# Altium schematic sheet power-supply_project-nr-22_Sch.SchDoc
size A4; SheetNumber: 1; SheetTotal: 1
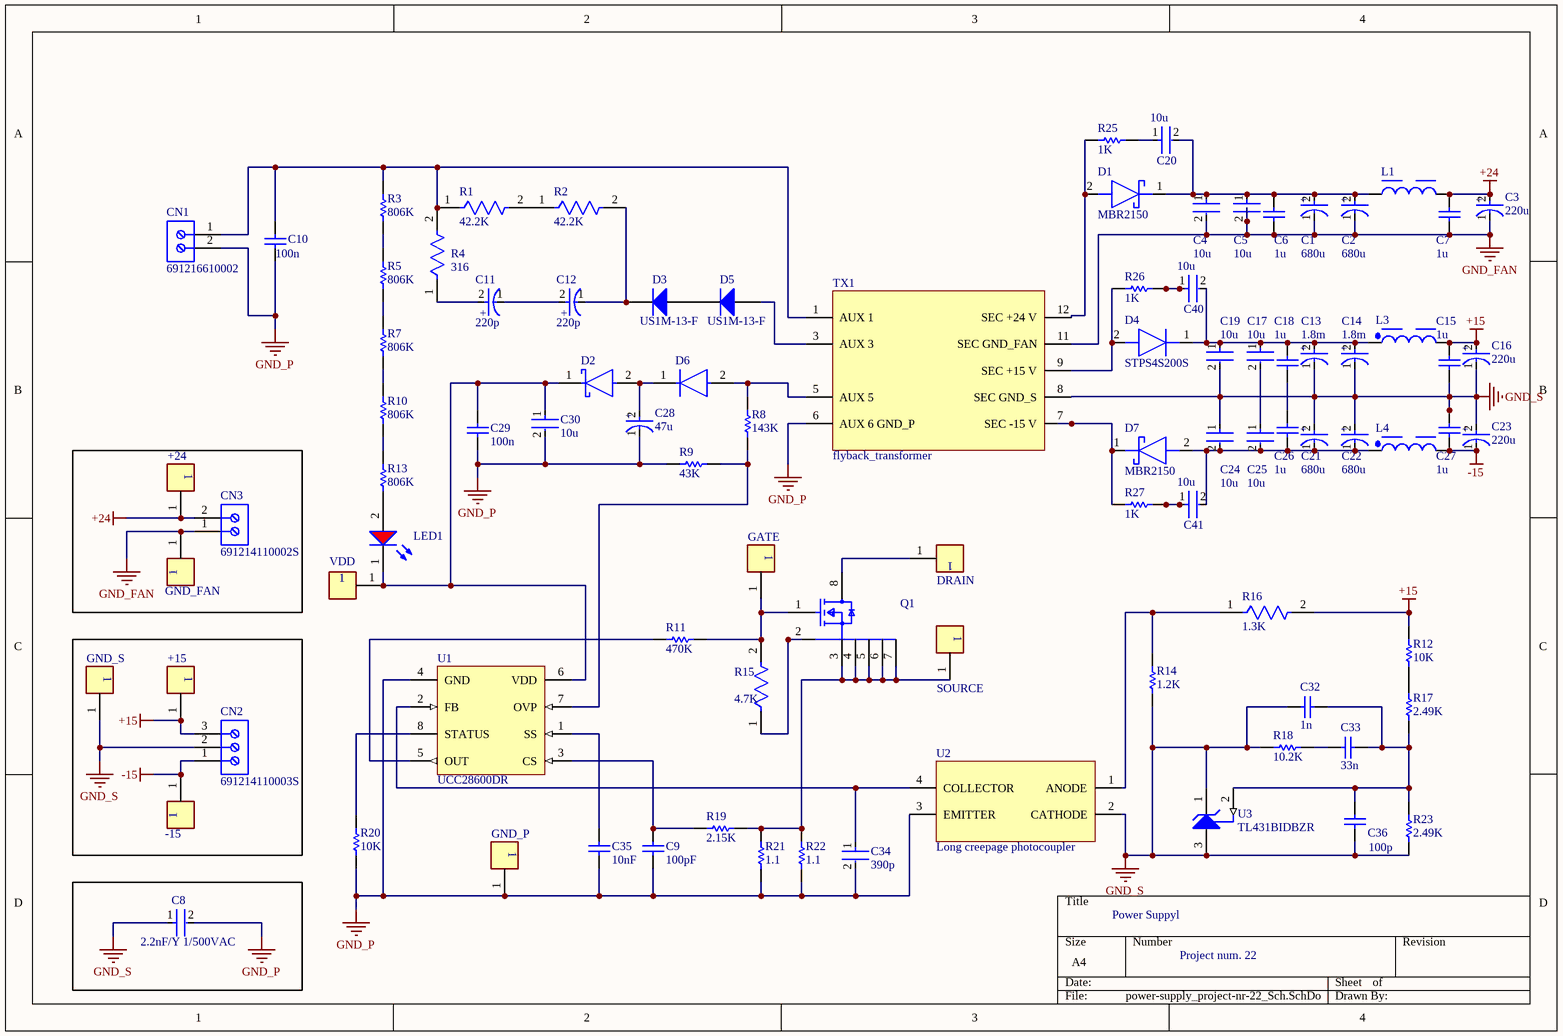
[diagram p0: power-supply_project-nr-22_Sch.SchDoc]

## Parts
+15  5002  [FP-5002-MFG]  (value not drawn)
+24  5002  [FP-5002-MFG]  (value not drawn)
-15  5002  [FP-5002-MFG]  (value not drawn)
C1  680u  [FP-EEU-FM1V681B-MFG]
C2  680u  [FP-EEU-FM1V681B-MFG]
C3  220u  [FP-UWT1V221MNL1GS-MFG]
C4  10u  [FP-C3216-160-0_3-MFG]
C5  10u  [FP-C3216-160-0_3-MFG]
C6  1u  [WCAP-CSGP_0805_L2W1.25H1.25]
C7  1u  [WCAP-CSGP_0805_L2W1.25H1.25]
C8  2.2nF/Y 1/500VAC  [FP-DE1_D11_T6_F10_d0_6-0-MFG]
C9  100pF  [WCAP-CSGP_0603_L1.6W0.8H0.8_Reflow]
C10  100n  [WCAP-FTBE_L18W8.5H15]
C11  220p  [FP-EEH-D-MFG]
C12  220p  [FP-EEH-D-MFG]
C13  1.8m  [FP-RAD-TH-D_10_0_5-L_25_2-MFG]
C14  1.8m  [FP-RAD-TH-D_10_0_5-L_25_2-MFG]
C15  1u  [WCAP-CSGP_0805_L2W1.25H1.25]
C16  220u  [FP-UWT1V221MNL1GS-MFG]
C17  10u  [FP-C3216-160-0_3-MFG]
C18  1u  [WCAP-CSGP_0805_L2W1.25H1.25]
C19  10u  [FP-C3216-160-0_3-MFG]
C20  10u  [FP-C3216-160-0_3-MFG]
C21  680u  [FP-EEU-FM1V681B-MFG]
C22  680u  [FP-EEU-FM1V681B-MFG]
C23  220u  [FP-UWT1V221MNL1GS-MFG]
C24  10u  [FP-C3216-160-0_3-MFG]
C25  10u  [FP-C3216-160-0_3-MFG]
C26  1u  [WCAP-CSGP_0805_L2W1.25H1.25]
C27  1u  [WCAP-CSGP_0805_L2W1.25H1.25]
C28  47u  [FP-HDD8-MFG]
C29  100n  [WCAP-CSGP_0603_L1.6W0.8H0.8_Reflow]
C30  10u  [FP-C3216-160-0_3-MFG]
C32  1n  [WCAP-CSGP_0603_L1.6W0.8H0.8_Reflow]
C33  33n  [WCAP-CSGP_0603_L1.6W0.8H0.8_Reflow]
C34  390p  [FP-C0603C-CF-MFG]
C35  10nF  [WCAP-CSGP_0603_L1.6W0.8H0.8_Reflow]
C36  100p  [WCAP-CSGP_0603_L1.6W0.8H0.8_Reflow]
C40  10u  [FP-C3216-160-0_3-MFG]
C41  10u  [FP-C3216-160-0_3-MFG]
CN1  691216610002  [691216610002]
CN2  691214110003S  [691214110003S]
CN3  691214110002S  [691214110002S]
D1  MBR2150  [DIOAD1910W86L670D310]
D2  MBR0540  [FP-425-04-MFG]  (value not drawn)
D3  US1M-13-F  [DIOD-SMA-2_A_V]
D4  STPS4S200S  [DIOM8059X265N]
D5  US1M-13-F  [DIOD-SMA-2_A_V]
D6  US1D-E3/61T  [FP-95400-MFG]  (value not drawn)
D7  MBR2150  [DIOAD1910W86L670D310]
DRAIN  5002  [FP-5002-MFG]  (value not drawn)
GATE  5002  [FP-5002-MFG]  (value not drawn)
GND_FAN  5002  [FP-5002-MFG]  (value not drawn)
GND_P  5002  [FP-5002-MFG]  (value not drawn)
GND_S  5002  [FP-5002-MFG]  (value not drawn)
L1  744025003  [WE-TPC_2828]  (value not drawn)
L3  7440520018  [WE-TPC_5818]  (value not drawn)
L4  744773022  [WE-PD2_4532]  (value not drawn)
LED1  150080RS75000  [WL-SMCW_0805_150080xx75000]  (value not drawn)
Q1  IMBF170R1K0M1XTMA1  [FP-PG-TO263-7-MFG]  (value not drawn)
R1  42.2K  [FP-RN55-MFG]
R2  42.2K  [FP-RN55-MFG]
R3  806K  [RESC3116X65X40NL10T20]
R4  316  [FP-CRCW0402-e3-MFG]
R5  806K  [RESC3116X65X40NL10T20]
R7  806K  [RESC3116X65X40NL10T20]
R8  143K  [RESC3116X65X40ML10T20]
R9  43K  [RESC1206(3216)_N]
R10  806K  [RESC3116X65X40NL10T20]
R11  470K  [RESC3116X65X40LL10T20]
R12  10K  [RESC3116X65X40ML10T20]
R13  806K  [RESC3116X65X40NL10T20]
R14  1.2K  [RESC0603X26X15LL03T05]
R15  4.7K  [FP-RC1206-0_65-IPC_B]
R16  1.3K  [FP-CRCW0805-e3-IPC_A]
R17  2.49K  [RESC3116X65X40ML10T20]
R18  10.2K  [RESC3116X65X40LL10T20]
R19  2.15K  [RESC1005X40X25ML05T05]
R20  10K  [RESC3116X65X40ML10T20]
R21  1.1  [RESC1608X55X30NL20T10]
R22  1.1  [RESC1608X55X30NL20T10]
R23  2.49K  [RESC3116X65X40ML10T20]
R25  1K  [RESC1608X55X30LL15T15]
R26  1K  [RESC1608X55X30LL15T15]
R27  1K  [RESC1608X55X30LL15T15]
SOURCE  5002  [FP-5002-MFG]  (value not drawn)
TX1  flyback_transformer  [flyback_transformer]
U1  UCC28600DR  [D0008A_M]
U2  Long creepage photocoupler  [PCBComponent_1]
U3  TL431BIDBZR  [DBZ0003A_N]
VDD  5002  [FP-5002-MFG]  (value not drawn)

## Nets
+15: +15.1 C15.2 C16.2(A) CN2.3 L3.2 R12.2 R16.2
+24: +24.1 C3.2(A) C7.2 CN3.2 L1.2
-15: -15.1 C23.1(C) C27.1 CN2.1 L4.2
GND_FAN: C1.1(C) C2.1(C) C3.1(C) C4.2 C5.2 C6.1 C7.1 CN3.1 GND_FAN.1 TX1.11(SEC_GND_FAN)
GND_P: C8.2 C9.1 C10.1 C28.1(C) C29.1 C30.2 C34.2 C35.1 CN1.2 GND_P.1 R9.1 R20.1 R21.1 R22.1 TX1.6(AUX_6_GND_P) U1.4(GND) U2.3(EMITTER)
GND_S: C8.1 C13.1(C) C14.1(C) C15.1 C16.1(C) C19.2 C21.2(A) C22.2(A) C23.2(A) C24.1 C27.2 C32.1 C36.1 CN2.2 GND_S.1 R14.1 R18.1 R23.1 TX1.8(SEC_GND_S) U2.2(CATHODE) U3.1(CATHODE) U3.3(ANODE)
NetC1_2: C1.2(A) C2.2(A) C4.1 C5.1 C6.2 C20.2 D1.1(K) L1.1
NetC9_2: C9.2 R19.1 U1.3(CS)
NetC10_2: C10.2 CN1.1 R1.1 R3.2 R4.2 TX1.1(AUX_1)
NetC11_1: C11.1(C) C12.2(A)
NetC11_2: C11.2(A) R4.1
NetC12_1: C12.1(C) D3.2(K) R2.2
NetC13_2: C13.2(A) C14.2(A) C17.1 C18.2 C19.1 C40.2 D4.1(K) L3.1
NetC17_2: C17.2 C25.1
NetC18_1: C18.1 C26.2
NetC20_1: C20.1 R25.2
NetC21_1: C21.1(C) C22.1(C) C24.2 C25.2 C26.1 C41.2 D7.2(A) L4.1
NetC28_2: C28.2(A) D2.2(A) D6.1(C)
NetC29_2: C29.2 C30.1 D2.1(C) LED1.1(K) U1.6(VDD) VDD.1
NetC32_2: C32.2 C33.2 C36.2 R17.1 R23.2 U3.2(REF)
NetC33_1: C33.1 R18.2
NetC34_1: C34.1 U1.2(FB) U2.4(COLLECTOR)
NetC35_2: C35.2 U1.1(SS)
NetC40_1: C40.1 R26.2
NetC41_1: C41.1 R27.2
NetD1_2: D1.2(A) R25.1 TX1.12(SEC_+24_V)
NetD3_1: D3.1(A) D5.2(K)
NetD4_2: D4.2(A) R26.1 TX1.9(SEC_+15_V)
NetD5_1: D5.1(A) TX1.3(AUX_3)
NetD6_2: D6.2(A) R8.2 TX1.5(AUX_5)
NetD7_1: D7.1(K) R27.1 TX1.7(SEC_-15_V)
NetDRAIN_1: DRAIN.1 Q1.8(DRAIN)
NetGATE_1: GATE.1 Q1.1(GATE) R11.2 R15.2
NetLED1_2: LED1.2(A) R13.1
NetQ1_2: Q1.2(SENSE) R15.1
NetQ1_3: Q1.3(SOURCE) Q1.4(SOURCE) Q1.5(SOURCE) Q1.6(SOURCE) Q1.7(SOURCE) R19.2 R21.2 R22.2 SOURCE.1
NetR1_2: R1.2 R2.1
NetR3_1: R3.1 R5.2
NetR5_1: R5.1 R7.2
NetR7_1: R7.1 R10.2
NetR8_1: R8.1 R9.2 U1.7(OVP)
NetR10_1: R10.1 R13.2
NetR11_1: R11.1 U1.5(OUT)
NetR12_1: R12.1 R17.2
NetR14_2: R14.2 R16.1 U2.1(ANODE)
NetR20_2: R20.2 U1.8(STATUS)

## Notes on the sheet
- Power Suppyl
- Project num. 22
- (in symbol CMP-00287-44406341-1) +
- (in symbol CMP-05427-000051-1) +
- (in symbol CMP-05427-001568-1) +
- (in symbol CMP-05428-001309-1) +
- (in symbol CMP-12462-000057-1) +

## Library data of the parts
+15 +24 -15 DRAIN GATE GND_FAN GND_P GND_S SOURCE VDD = CMP-2000-05182-2: PC TEST POINT MINIATURE WHITE; Body Material: Bronze; Insulation: Insulated; Inside Diameter: 1.27mm; Number of Ports: 1; Outside Diameter: 2.54mm; Hole Diameter: 1.6mm; Plating: Silver; Contact Plating: Silver; Orientation: Straight; REACH SVHC: No SVHC; Series: THM; Packaging: Bulk; Material: Nylon; Flammability Rating: UL94 V-0; Mount: Through Hole; Color: White; Housing Color: White; Length: 7.62mm; Contact Material: Bronze; Lead Free: Lead Free; Package Quantity: 100; RoHS Compliant: Yes
C1 C2 C21 C22 = CMP-05427-000051-1: CAP ALUM 680UF 20% 35V RADIAL; Polarity: Polar; Dissipation Factor: 0.12%; Impedance: 18mR; Life (Hours): 5000Hour; Lead Diameter: 0.6mm; Ripple Current: 2.6A; Tolerance: 20%; Lead Pitch: 5mm; Capacitance: 680uF; Lead Free: Lead Free; Max Operating Temperature: 105°C; Series: FM; Packaging: Tape and Reel; Voltage Rating (DC): 35V; Radiation Hardening: No; Package Quantity: 500; Height: 20mm; Mount: Through Hole; Length: 20mm; Termination: Radial; REACH SVHC: No SVHC; Case/Package: Radial; Contact Plating: Tin; Height - Seated (Max): 0.866inch; Voltage Rating: 35V; Min Operating Temperature: -40°C; RoHS Compliant: Yes; Diameter: 12.5mm; ESR (Equivalent Series Resistance): 18mR
C3 C16 C23 = CMP-12462-000057-1: CAP ALUM 220UF 20% 35V SMD; Dielectric Material: Aluminium; Ripple Current: 190mA; Leakage Current: 3uA; Lead Diameter: 1.1mm; Dissipation Factor: 0.14%; Life (Hours): 1000Hour; Lead Pitch: 0.327inch; Radiation Hardening: No; Termination: SMD/SMT; Min Operating Temperature: -55°C; Construction: Cylindrical; Voltage Rating (DC): 35V; Capacitance: 220uF; Package Quantity: 500; Voltage Rating: 35V; RoHS Compliant: Yes; Height - Seated (Max): 0.394inch; Length: 10mm; Lead Free: Lead Free; Voltage: 35V; Diameter: 8mm; Max Operating Temperature: 105°C; Height: 10mm; REACH SVHC: No SVHC; Number of Pins: 2; Mount: Surface Mount; Case/Package: Radial; Packaging: Tape and Reel; Tolerance: 20%; Ripple Current (AC): 190mA; Series: WT
C4 C5 C17 C19 C20 C24 C25 C30 C40 C41 = CMP-08246-004811-1: Multilayer Ceramic Capacitors 10uF ±10% 50V X7R SMD 1206; RoHS Compliant: Yes
C6 C7 C15 C18 C26 C27 = CMP-03913-65419874-1: 885012207103 Ceramic Capacitor, Multilayer, Ceramic, 50V, 10% +Tol, 10% -Tol, X7R, 15% TC, 1uF, Surface Mount, 0805; Capacitance: 1µF; Insulation Resistance: 100MΩ; Height: 1.25mm; Width: 1.25mm; Case Code (Metric): 2012; Voltage Rating (DC): 50V; Min Operating Temperature: -55°C; Case/Package: 0805; RoHS: Compliant; REACH SVHC: Unknown; Case Code (Imperial): 0805; Packaging: Tape & Reel (TR); Thickness: 1.3462mm; NexarPartId: 65419874; Mount: Surface Mount; Tolerance: 10%; Max Operating Temperature: 125°C; Dielectric: X7R; Voltage Rating: 50V; Length: 2mm
C8 = CMP-06035-036471-1: Cap Ceramic Disc 2200pF 20% 500VAC Thru-Hole 11.0x6.0x10.0 Ammo pack
C9 C36 = CMP-03913-53914762-1: 885012206053 Capacitor 100pF Multilayer Ceramic MLCC25 V , X7R Dielectric 0603 Surface Mount; Tolerance: 10%; Voltage Rating (DC): 25V; Insulation Resistance: 10GΩ; Case/Package: 0603; NexarPartId: 53914762; Case Code (Imperial): 0603; Max Operating Temperature: 125°C; Length: 1.6mm; Capacitance: 100pF; Voltage Rating: 25V; Dielectric: X7R; Height: 800µm; Packaging: Tape & Reel (TR); Mount: Surface Mount; RoHS: Compliant; Thickness: 939.8µm; Case Code (Metric): 1608; Width: 800µm; Min Operating Temperature: -55°C
C10 = CMP-03913-89437353-1: 890493425009CS Cap, 0.1Uf, 1Kv, Film, Radial Rohs Compliant: Yes; Pitch: 15mm; Pin Length: 4mm; ESR (Equivalent Series Resistance): 380mΩ; Capacitance: 100nF; Insulation Resistance: 9GΩ; Packaging: Carton; Voltage Rating: 1kV; Length: 18mm; Width: 8.5mm; NexarPartId: 89437353; RoHS: Compliant; Height: 15mm
C11 C12 = CMP-05428-001309-1: Aluminum Hybrid Polymer Capacitors 22uF 20% 50V Life 10000Hours AEC-Q200 RADIAL SMT; Ripple Current (AC): 1.1A; Lead Diameter: 0.65mm; Life (Hours): 5000Hour; ESR (Equivalent Series Resistance): 80mR; Leakage Current: 100uA; Technology: HYBRID; Height - Seated (Max): 0.24inch; Voltage Rating (DC): 50V; Min Operating Temperature: -55°C; Voltage Rating: 50V; Length: 5.8mm; Tolerance: 20%; Lead Pitch: 1.8mm; Voltage: 50V; Packaging: Tape and Reel; Mount: Surface Mount; REACH SVHC: No SVHC; Ripple Current: 1.1A; Case/Package: Radial; Package Quantity: 1000; Capacitance: 22uF; Series: ZA; Construction: Cylindrical; Diameter: 6.3mm; Height: 5.8mm; Max Operating Temperature: 105°C; Lead Free: Lead Free; RoHS Compliant: Yes; Termination: SMD/SMT; Material: Polymer; Radiation Hardening: No; Ratings: AEC-Q200
C13 C14 = CMP-05427-001568-1: CAP ALUM 1800UF 20% 6.3V RADIAL; Dissipation Factor: 0.22%; ESR (Equivalent Series Resistance): 45mR; Ripple Current: 1.44A; Capacitance: 1.8mF; Life (Hours): 3000Hour; Dielectric Material: Aluminium; Leakage Current: 3uA; Lead Diameter: 0.6mm; Polarity: Polar; Diameter: 10mm; Packaging: Bulk; Radiation Hardening: No; Voltage Rating (DC): 6.3V; Mount: Through Hole; Impedance: 45mR; Package Quantity: 200; Min Operating Temperature: -55°C; RoHS Compliant: Yes; Size: 25mm; Lead Free: Lead Free; Height - Seated (Max): 0.984inch; Max Operating Temperature: 105°C; Termination: Radial; Construction: RADIAL; Tolerance: 20%; Length: 25mm; REACH SVHC: No SVHC; Height: 25mm; Number of Pins: 2; Series: FC; Voltage: 6.3V; Lead Pitch: 5mm; Case/Package: Radial; Ratings: AEC-Q200; Voltage Rating: 6.3V
C28 = CMP-00287-44406341-1: EEE-HDV470XAP Radial Can - SMD Aluminum Electrolytic Capacitor Hd-v 35V 47MUF ±20% 0.248DIA 6.30MM; Leakage Current: 16.4µA; ESR (Equivalent Series Resistance): 2Ω; Ripple Current (AC): 57mA; Capacitance: 47µF; Dissipation Factor: 0.14%; Life (Hours): 5000hours; Polarity: Polar; Min Operating Temperature: -40°C; Voltage: 35V; Radiation Hardening: No; NexarPartId: 44406341; Voltage Rating (DC): 35V; Mount: PCB, Surface Mount; Packaging: Tape & Reel (TR); Impedance: 2Ω; Height - Seated (Max): 7.6962mm; Contact Plating: Tin; RoHS: Compliant; Ripple Current: 57mA; Diameter: 6.3mm; Length: 8mm; REACH SVHC: Unknown; Termination: SMD/SMT; Case/Package: Radial; Schedule B: 8532220020, 8532220020; Lead Free: Lead Free; Height: 7.7mm; Tolerance: 20%; Max Operating Temperature: 105°C; Voltage Rating: 35V
C29 = CMP-207839-000004-2: CAP CER 0.1UF 50V X7R 0603; NexarPartId: 53914804; Tolerance: 10%; Insulation Resistance: 5GΩ; Capacitance: 100nF; Material: Ceramic; RoHS: Compliant; Voltage Rating (DC): 50V; Case Code (Metric): 1608; Case Code (Imperial): 0603; Mount: Surface Mount; Dielectric: X7R; Length: 1.6mm; Packaging: Cut Tape (CT); Max Operating Temperature: 125°C; Case/Package: 0603; Voltage Rating: 50V; Thickness: 939.8µm; Min Operating Temperature: -55°C; Width: 800µm; Height: 800µm; REACH SVHC: Unknown
C32 = CMP-03913-53914768-1: 885012206059 WCAP-CSGP 0603 (1608Metric) Ceramic Capacitor 0.063Lx0.031W 1.60mmx0.80mm X7R ±10% 1000pF; Capacitance: 1nF; Insulation Resistance: 10GΩ; Voltage Rating: 25V; NexarPartId: 53914768; Thickness: 939.8µm; Dielectric: X7R; RoHS: Compliant; Min Operating Temperature: -55°C; Case/Package: 0603; Width: 800µm; Tolerance: 10%; Max Operating Temperature: 125°C; Voltage Rating (DC): 25V; Height: 800µm; Case Code (Imperial): 0603; Packaging: Tape & Reel (TR); Length: 1.6mm; Case Code (Metric): 1608; Mount: Surface Mount
C33 = CMP-03913-53914777-1: 885012206068 Ceramic Capacitor 33nF, 25VDC, 0603, ±10 %; Tolerance: 10%; Voltage Rating: 25V; Insulation Resistance: 10GΩ; Dielectric: X7R; Packaging: Tape & Reel (TR); Capacitance: 33nF; Voltage Rating (DC): 25V; NexarPartId: 53914777; Case Code (Metric): 1608; Width: 800µm; Mount: Surface Mount; Case Code (Imperial): 0603; Length: 1.6mm; Min Operating Temperature: -55°C; Max Operating Temperature: 125°C; Case/Package: 0603; Height: 800µm; RoHS: Compliant; Thickness: 939.8µm
C34 = CMP-03020-025182-1: Cap Ceramic 390pF 25V X7R 10% SMD 0603 125°C Paper T/R; Manufacturer Part Number: C0603C391K3RACTU; Manufacturer: KEMET; Temperature Coefficient: 30ppm/°C; Automotive Grade: Grade 1; Tolerance: 0.1; Mouser Description: Cap Ceramic 390pF 25V X7R 10% SMD 0603 125°C Paper T/R; Material: Ceramic; Temperature Characteristic: X7R; Lead Free: Yes; RoHS: TRUE; Device Class L2: Capacitors; Automotive: Yes; Device Class L1: Passive Components; Digikey Description: Cap Ceramic 390pF 25V X7R 10% SMD 0603 125°C Paper T/R; Temperature: -55°C to +125°C; Category: Cap; Temperature Range High: +125°C; ComponentLink2Description: Datasheet; Temperature Range Low: -55°C; Height: 0.87mm; Device Class L3: Ceramic Capacitors; Capacitance: 390 pF; Value: 390 pF; Voltage Rating: 25 V; ComponentLink2URL: https://api.kemet.com/component-edge/download/datasheet/C0603C100J5GACAUTO.pdf; Octopart: https://octopart.com/c0603c391k3ractu-kemet-16846599; Package: C0603C-CF
C35 = CMP-03913-53914774-1: 885012206065 Cap Cer 10000PF 25V X7R 0603; Insulation Resistance: 10GΩ; Tolerance: 10%; REACH SVHC: Unknown; Height: 800µm; NexarPartId: 53914774; Case Code (Metric): 1608; Voltage Rating: 25V; Case Code (Imperial): 0603; Width: 800µm; Max Operating Temperature: 125°C; Min Operating Temperature: -55°C; Mount: Surface Mount; Capacitance: 10nF; Voltage Rating (DC): 25V; Length: 1.6mm; Dielectric: X7R; Case/Package: 0603; Packaging: Tape & Reel (TR); RoHS: Compliant; Thickness: 939.8µm
CN1 = CMP-1502-02820-2: NexarPartId: 78871186; Packaging: Box; Number of Pins: 2; Lead Pitch: 10.16mm; RoHS: Non-Compliant
CN2 = CMP-1502-02467-2: NexarPartId: 105950668
CN3 = CMP-1502-02465-2: NexarPartId: 94172715; Voltage Rating: 300V; Number of Contacts: 2; Current Rating: 10A; Lead Pitch: 3.5mm; Height: 9.2mm; Min Operating Temperature: -30°C; Number of Pins: 2; Packaging: Box; Max Operating Temperature: 120°C; Contact Material: Nickel, Tin; Number of Rows: 1
D1 D7 = MBR2150: Schottky Diode; Manufacturer_Name: PANJIT; Datasheet Link: https://www.panjit.com.tw/en/Product/downloadPDF/MBR2150; Manufacturer_Part_Number: MBR2150
D2 = CMP-2000-05114-2: DIODE SCHOTTKY 40V 500MA SOD123; Max Surge Current: 5.5A; Max Reverse Leakage Current: 20uA; Forward Voltage: 620mV; Element Configuration: Single; Polarity: Standard; Power Dissipation: 400mW; Current Rating: 500A; Max Operating Temperature: 125°C; REACH SVHC: No SVHC; Voltage Rating (DC): 40V; Mount: Surface Mount; Max Reverse Voltage (DC): 40V; Max Forward Surge Current (Ifsm): 5.5A; Height: 1.03mm; Package Quantity: 3000; Forward Current: 500mA; Average Rectified Current: 500mA; Weight: 0.03g; Output Current: 500mA; Contact Plating: Tin; Packaging: Tape and Reel; Width: 1.6mm; Radiation Hardening: No; Peak Non-Repetitive Surge Current: 5.5A; Max Repetitive Reverse Voltage (Vrrm): 40V; Length: 2.7mm; Lead Free: Lead Free; Min Operating Temperature: -65°C; Number of Pins: 2; Peak Reverse Current: 20uA
D3 D5 = CMP-2000-07364-1: Ultra-Fast Rectifier, 1 A, 1.7 V, -65 to 150 degC, 2-Pin SMA, RoHS, Tape and Reel; Manufacturer: Diodes Inc; Forward Voltage: 1.7V; Reverse Recovery Time-Max: 75ns; Average Rectified Current-Max: 1A; Reverse Current-Max: 5µA; Reverse Voltage-Max [Vrrm]: 1000V; Package Description: 2-Pin Surface Mount Device, Body 4.3 x 2.605 mm; Datasheet URL: http://www.diodes.com/_files/datasheets/ds16008.pdf; Datasheet Version: Rev. 11-2, 12/2014; Package Reference: SMA-2; Mounting Technology: SurfaceMount; Manufacturer URL: http://www.diodes.com/
D4 = STPS4S200S: Diode; Manufacturer_Name: STMicroelectronics; Datasheet Link: http://www.st.com/content/ccc/resource/technical/document/datasheet/f1/ca/76/fb/56/90/40/1c/DM00136818.pdf/files/DM00136818.pdf/jcr:content/translations/en.DM00136818.pdf; Height: 2.65mm; Manufacturer_Part_Number: STPS4S200S; Mouser Part Number: 511-STPS4S200S; Mouser Price/Stock: https://www.mouser.co.uk/ProductDetail/STMicroelectronics/STPS4S200S?qs=BA62vJVifGo1urUInSDhRQ%3D%3D; Arrow Part Number: STPS4S200S; Arrow Price/Stock: https://www.arrow.com/en/products/stps4s200s/stmicroelectronics?region=europe
D6 = CMP-02540-000106-1: DIODE GEN PURP 200V 1A DO214AC; Element Configuration: Single; Max Reverse Current: 10uA; Reverse Recovery Time: 50ns; Polarity: Standard; Forward Voltage: 1V; Max Forward Surge Current (Ifsm): 30A; Diode Type: RECTIFIER; Capacitance: 15pF; Reverse Voltage: 200V; RoHS Compliant: Yes; Average Rectified Current: 1A; Voltage: 200V; Output Current: 1A; Min Operating Temperature: -55°C; Lead Free: Lead Free; Case/Package: SMA; Length: 4.5mm; Width: 2.79mm; Voltage Rating (DC): 200V; Max Repetitive Reverse Voltage (Vrrm): 200V; Radiation Hardening: No; Forward Current: 1A; Max Operating Temperature: 150°C; Number of Pins: 2; Reverse Recovery Time-Max: 50ns; Packaging: Tape and Reel; Current Rating: 1A; Max Surge Current: 30A; Max Reverse Voltage (DC): 200V; Package Quantity: 1; Peak Non-Repetitive Surge Current: 30A; Mount: Surface Mount; Current: 1A; Series: -; Height: 2.09mm; Recovery Time: 50ns
L1 = CMP-1479-00012-3: NexarPartId: 23283652; Self Resonant Frequency: 100MHz; Inductance Tolerance: 20%; Current Rating: 1.5A; DC Resistance (DCR): 85mΩ; Inductance: 3.3µH; Ambient Temperature Range High: 85°C; Min Operating Temperature: -40°C; Width: 2.8mm; Height: 2.8mm; Max Operating Temperature: 125°C; Length: 2.8mm; RoHS: Compliant; Number of Pins: 2; Packaging: Tape & Reel (TR); Ambient Temperature Range Low: -40°C
L3 = CMP-0227-00403-3: NexarPartId: 22803239; Inductance: 1.8µH; Test Frequency: 100kHz; Max DC Current: 1.6A; Shielding: Shielded; Self Resonant Frequency: 100MHz; Tolerance: 30%; RMS Current (Irms): 2.6A; DC Resistance (DCR): 24mΩ; Saturation Current: 3A; Core Material: Ferrite; RoHS: Compliant; Case Code (Metric): 5858; Width: 5.8mm; Mount: Surface Mount; Min Operating Temperature: -40°C; Case Code (Imperial): 2323; Number of Pins: 2; Height - Seated (Max): 2.0066mm; Weight: 248.001628mg; Length: 5.8mm; Ambient Temperature Range Low: -40°C; Current Rating: 2.6A; REACH SVHC: Unknown; Inductance Tolerance: 30%; Height: 1.8mm; Composition: Wirewound; Termination: SMD/SMT; Ambient Temperature Range High: 95°C; Packaging: Cut Tape (CT); Max Operating Temperature: 125°C; Case/Package: 2323
L4 = CMP-0227-00486-2: NexarPartId: 7866434; Core Material: Ferrite; DC Resistance (DCR): 34mΩ; Inductance Tolerance: 20%; Test Frequency: 10kHz; Self Resonant Frequency: 85MHz; Saturation Current: 3.38A; Current Rating: 2.5A; Resistance: 71mΩ; Inductance: 2.2µH; Shielding: Unshielded; Packaging: Tape & Reel (TR); Ambient Temperature Range High: 85°C; Lead Free: Lead Free; Height: 3.2mm; Min Operating Temperature: -40°C; Tolerance: 20%; Termination: SMD/SMT; Mount: Surface Mount; Width: 4.5mm; Composition: Wirewound; RMS Current (Irms): 2.5A; Height - Seated (Max): 3.5052mm; RoHS: Compliant; Max DC Current: 2.5A; Number of Pins: 2; Max Operating Temperature: 125°C; REACH SVHC: Unknown; Length: 4mm; Case/Package: Nonstandard; Ambient Temperature Range Low: -40°C
LED1 = CMP-1426-00011-2: NexarPartId: 29717781; Peak Wavelength: 630nm; Wavelength: 625nm; Viewing Angle: 140°; Test Current: 20mA; Forward Voltage: 2V; Forward Current: 100mA; Lens Style: Clear, Rectangular; Color: Red; Luminous Intensity: 150mcd; Max Reverse Voltage (DC): 5V; Length: 2mm; Case Code (Imperial): 0805; RoHS: Compliant; Max Operating Temperature: 85°C; Height: 700µm; Packaging: Tape and Reel; Case/Package: 0805; REACH SVHC: Unknown; Dominant Wavelength: 625nm; Min Operating Temperature: -40°C; Case Code (Metric): 2012; Mount: Surface Mount; Width: 1.25mm
Q1 = CMP-32901-000934-1: SIC MOSFET 1700V; Continuous Drain Current (ID): 5.2A; Rds On Max: 1R; Input Capacitance: 275pF; Max Power Dissipation: 68W; Drain to Source Voltage (Vdss): 1.7kV; Min Operating Temperature: -55°C; Series: CoolSiC™; Case/Package: TO-263-7; Max Operating Temperature: 175°C
R1 R2 = CMP-00030-42945145-1: RN55D4222FRE6 Res Metal Film 42.2K Ohm 1% 1/8W ±100ppm/°C Conformal AXL Thru-Hole T/R; Power Rating: 125mW; Resistance: 42.2kΩ; Lead Diameter: 640µm; Voltage Rating: 200V; Radiation Hardening: No; Number of Terminations: 2; Tolerance: 1%; Contact Plating: Lead, Tin; Mount: Through Hole; Composition: Metal Film; Max Operating Temperature: 175°C; NexarPartId: 42945145; Features: Flame Retardant Coating, Military, Moisture Resistant; Case/Package: Axial; Max Power Dissipation: 125mW; Military Standard: MIL-R-10509; Termination: Axial; Temperature Coefficient: 100ppm/°C; Min Operating Temperature: -65°C; RoHS: Non-Compliant; Diameter: 2.29mm; Width: 2.29mm; Lead Free: Contains Lead; Length: 6.096mm
R3 R5 R7 R10 R13 = CMP-2003-03875-1: Manufacturer: Yageo; Part Number: RC1206FR-07806KL
R4 = CMP-2002-08514-2: RES Thick Film, 316Ω, 1%, 0.063W, 100ppm/°C, 0402; Voltage Rating: 50V; Resistance: 316R; Max Power Dissipation: 63mW; Composition: Thick Film; Width: 0.5mm; Case Code (Imperial): 0402; Package Quantity: 10; Case/Package: 0402; Case Code (Metric): 1005; Contact Plating: Tin; Min Operating Temperature: -55°C; Max Operating Temperature: 155°C; Military Standard: Not; Temperature Coefficient: 100ppm/°C; Radiation Hardening: No; Packaging: Tape and Reel; Number of Terminations: 2; Features: Automotive AEC-Q200; Tolerance: 1%; Length: 1mm; Lead Free: Lead Free; Weight: 2.3E-05oz; Height: 0.016inch; Depth: 0.5mm; Power Rating: 63mW; Voltage Rating (DC): 50V
R8 = CMP-2003-03555-1: Part Number: RC1206FR-07143KL; Manufacturer: Yageo
R9 = CMP-1014-00694-1: 43K 0.25W 1% 1206 (3216 Metric)  SMD; Value: 43000.00 Ohm; Case-EIA: 1206; Case-Metric: 3216; Tolerance: 1 %; Power: 0.25 W; Technology: SMT
R11 = CMP-2000-06970-1: Chip Resistor, 47 Ohm, +/- 1%, 250 mW, -55 to 155 degC, 1206 (3216 Metric), RoHS, Tape and Reel; Unit Weight: 0.000571oz; Voltage Rating: 200V; Brand: Yageo; Resistance: 47Ohms; Power Rating: 250mW(1/4W); Temperature Coefficient: 100PPM/C; Tolerance: 1%; Product Category: ThickFilmResistors; Product: ThickFilmResistorsGeneralPurpose; Package / Case: 1206(3216metric); Operating Temperature Range: -55Cto+155C; Width: 1.6mm; Case Code - mm: 3216; Manufacturer: Yageo; Type: GeneralPurposeChipResistors; Mounting Technology: SurfaceMount; Package Reference: 1206; Length: 3.2mm; Case Code - in: 1206; Package Description: 2-Pin Surface Mount Device, Body 3.1 x 1.6 mm; Datasheet Version: Rev. 7, 05/2017; Height: 0.55mm; Manufacturer URL: http://www.yageo.com/; Series: RC1206; Packaging: Reel; Termination Style: SMD/SMT; Datasheet URL: http://www.yageo.com/documents/recent/PYu-RC_Group_51_RoHS_L_7.pdf; RoHS: True
R12 R20 = CMP-1014-00623-2: Chip Resistor, 10 KOhm, +/- 1%, 0.25 W, -55 to 155 degC, 1206 (3216 Metric), RoHS, Tape and Reel; Manufacturer: Yageo; Voltage Rating: 200V; Resistance: 10KOhm; Temperature Coefficient: 100ppm/degreesC; Power Rating: 250mW; Packaging: TapeandReel; Termination: SMD/SMT; REACH SVHC: Unknown; Tolerance: 1%; Height: 0.55mm; Composition: ThickFilm; Max Operating Temperature: 155degC; Datasheet Version: Rev. 5, 10/2016; Lead Free: LeadFree; Case Code (Metric): 3216; Depth: 1.6mm; Package Quantity: 5000; RoHSCompliant: true; Military Standard: Not; Case/Package: 1206; Case Code (Imperial): 1206; Min Operating Temperature: -55degC; Datasheet URL: http://www.yageo.com/NewPortal/yageodocoutput?fileName=/pdf/R-Chip/PYu-RC_Group_51_RoHS_L_5.pdf; Length: 3.1mm; Manufacturer URL: http://www.yageo.com/; Package Reference: 1206.0; Width: 1.6mm; Package Description: 2-Pin Surface Mount Device, Body 3.1 x 1.6 mm
R14 = CMP-2004-02510-1: Part Number: MCRE000142; Manufacturer: Multicomp
R15 = CMP-03412-037805-1: RES SMD 4.7K OHM 1% 1/4W 1206; Max Power Dissipation: 250mW; Voltage Rating: 200V; Temperature Coefficient: 100ppm/°C; Resistance: 4.7kR; Construction: Rectangular; RoHS Compliant: Yes; Max Operating Temperature: 155°C; Tolerance: 1%; Height: 0.026inch; Features: Moisture Resistant; Military Standard: Not; Series: RC; Termination: SMD/SMT; Number of Terminations: 2; Number of Pins: 2; Case Code (Imperial): 1206; Case/Package: 1206; Case Code (Metric): 3216; Voltage Rating (DC): 200V; Width: 0.063inch; Min Operating Temperature: -55°C; Resistance Tolerance: 1%; Length: 0.122inch; Size Code: 1206; Lead Free: Lead Free; Depth: 1.6mm; Packaging: Tape and Reel; Package Quantity: 1; Power Rating: 250mW; Resistor Type: Thick Film
R16 = CMP-2001-03612-2: RES Thick Film, 1.3kΩ, 1%, 0.125W, 100ppm/°C, 0805; Voltage Rating: 150V; Resistance: 1.3kR; Power Rating: 125mW; Termination: SMD/SMT; Package Quantity: 10; Case Code (Imperial): 0805; Weight: 0.000194oz; Length: 2mm; Min Operating Temperature: -55°C; Mount: Surface Mount; Features: Automotive AEC-Q200; Tolerance: 1%; Number of Terminations: 2; Military Standard: Not; Depth: 1.25mm; Case/Package: 0805; Case Code (Metric): 2012; Width: 0.049inch; Max Power Dissipation: 125mW; Voltage Rating (DC): 150V; Lead Free: Lead Free; Radiation Hardening: No; Temperature Coefficient: 100ppm/°C; Packaging: Tape and Reel; Height: 0.45mm; Composition: Thick Film; Number of Pins: 2; Max Operating Temperature: 155°C; Contact Plating: Tin
R17 R23 = CMP-2003-03668-1: Manufacturer: Yageo; Part Number: RC1206FR-072K49L
R18 = CMP-2003-03538-1: Manufacturer: Yageo; Part Number: RC1206FR-0710K2L
R19 = CMP-2002-00772-1: Manufacturer: Panasonic; Part Number: ERJ-2RKF2151X
R21 R22 = CMP-2000-01272-1: Part Number: RK73H1JTTD1R10F; Manufacturer: KOA Speer
R25-R27 = CMP-2000-00180-1: Part Number: ERJ-3EKF1001V; Manufacturer: Panasonic
U1 = CMP-0319-00920-2: Quasi-Resonant Flyback Green-Mode Controller with Current Control, 99 % Duty Cycle, -40 to +105 degC, 8-pin SOIC (D), Green (RoHS & no Sb/Br); Manufacturer: Texas Instruments; Frequency(Max)(kHz): 130; UVLO Thresholds On/Off(V): 10.3/9.3; Duty Cycle(Max)(%): 99; Rating: Catalog; SubFamily: PWM Controller; Regulated Outputs(#): 1; PackageVersion: revM, Jun-2011; PartNumber: UCC28600DR; Code_JEDEC: MS-012AA; DatasheetVersion: SLUS646J; Eco-Plan: Green (RoHS & no Sb/Br); ComponentLink1URL: http://www.ti.com/general/docs/lit/getliterature.tsp?genericPartNumber=UCC28600&fileType=pdf; Control Method: Current; PackageReference: D0008A; Topology: Flyback; ComponentLink1Description: Datasheet; Mounting Technology: Surface Mount; PackageDescription: 8-Pin Plastic Small Outline Integrated Circuit, 4.9 x 3.9 mm, Pitch 1.27 mm Pitch
U3 = CMP-0366-01191-2: Adjustable Precision Shunt Regulator, 34 ppm / degC, 100 mA, -40 to 85 degC, 3-pin SOT-23 (DBZ), Green (RoHS & no Sb/Br); Manufacturer: Texas Instruments; Iout/Iz(Max)(mA): 100; Min Iz for Regulation(uA): 600; Initial Accuracy @ 25/deg C(%): 0.5; SubFamily: Shunt Voltage Reference; Temp Coeff(Max)(ppm/ degree C): 92; VO Adj(Max)(V): 36; Rating: Catalog; VO Adj(Min)(V): 2.495; Temp Coeff(Typ)(ppm/ degree C): 34; ComponentLink1URL: http://www.ti.com/; Mounting Technology: Surface Mount; ComponentLink2Description: Datasheet; PackageDescription: 3-Pin Plastic Small Outline, Body 2.92 x 1.3 mm, Pitch 0.95 mm; ComponentLink2URL: http://www.ti.com/general/docs/lit/getliterature.tsp?genericPartNumber=TL431B&fileType=pdf; ComponentLink3Description: Package Specification; Code_JEDEC: TO-236; PartNumber: TL431BIDBZR; ComponentLink1Description: Manufacturer URL; Eco-Plan: Green (RoHS & no Sb/Br); DatasheetVersion: SLVS543M; PackageReference: DBZ0003A; ComponentLink3URL: http://www.ti.com/litv/pdf/mpds108a; PackageVersion: 4203227/B